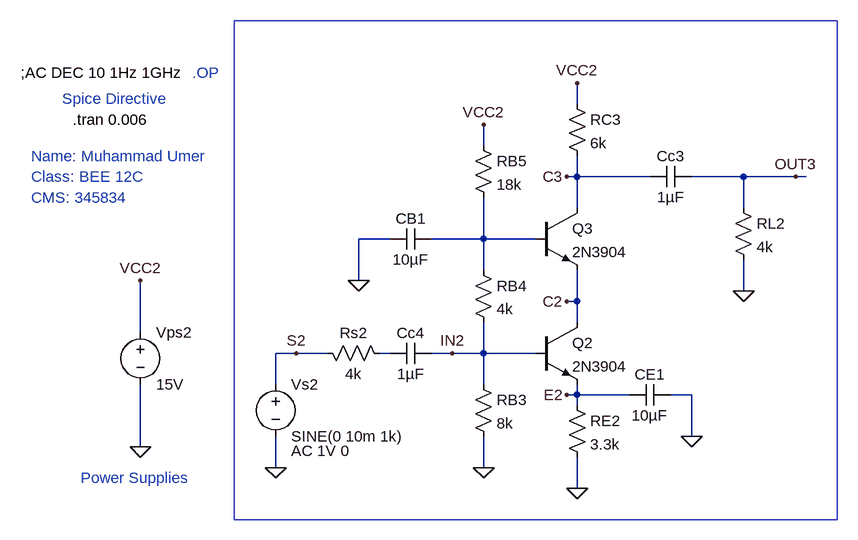
[diagram p0: schematic modified_ce_cascode.asc]
modified_ce_cascode.asc, the LTspice schematic file:
Version 4
SHEET 1 1920 1496
WIRE 736 544 736 512
WIRE 592 608 592 576
WIRE 736 656 736 624
WIRE 736 656 720 656
WIRE 848 656 736 656
WIRE 992 656 912 656
WIRE 1072 656 992 656
WIRE 1088 656 1072 656
WIRE 736 704 736 656
WIRE 992 704 992 656
WIRE 448 752 400 752
WIRE 592 752 592 688
WIRE 592 752 512 752
WIRE 672 752 592 752
WIRE 592 800 592 752
WIRE 400 816 400 752
WIRE 992 832 992 784
WIRE 736 848 736 800
WIRE 736 848 720 848
WIRE 736 880 736 848
WIRE 64 896 64 816
WIRE 304 928 272 928
WIRE 352 928 304 928
WIRE 448 928 432 928
WIRE 544 928 512 928
WIRE 592 928 592 880
WIRE 592 928 544 928
WIRE 672 928 592 928
WIRE 272 976 272 928
WIRE 592 976 592 928
WIRE 736 992 736 976
WIRE 736 992 720 992
WIRE 816 992 736 992
WIRE 912 992 880 992
WIRE 736 1008 736 992
WIRE 912 1056 912 992
WIRE 64 1072 64 976
WIRE 272 1104 272 1056
WIRE 592 1104 592 1056
WIRE 736 1136 736 1088
FLAG 736 512 VCC2
FLAG 720 848 C2
FLAG 720 992 E2
FLAG 912 1056 0
FLAG 992 832 0
FLAG 1072 656 OUT3
FLAG 592 1104 0
FLAG 272 1104 0
FLAG 304 928 S2
FLAG 544 928 IN2
FLAG 736 1136 0
FLAG 592 576 VCC2
FLAG 64 1072 0
FLAG 64 816 VCC2
FLAG 720 656 C3
FLAG 400 816 0
SYMBOL npn 672 880 R0
SYMATTR InstName Q2
SYMATTR Value 2N3904
SYMBOL res 720 992 R0
SYMATTR InstName RE2
SYMATTR Value 3.3k
SYMBOL cap 912 640 R90
WINDOW 0 0 32 VBottom 2
WINDOW 3 32 32 VTop 2
SYMATTR InstName Cc3
SYMATTR Value 1µF
SYMBOL cap 880 976 R90
WINDOW 0 0 32 VBottom 2
WINDOW 3 32 32 VTop 2
SYMATTR InstName CE1
SYMATTR Value 10µF
SYMBOL res 976 688 R0
SYMATTR InstName RL2
SYMATTR Value 4k
SYMBOL res 576 960 R0
SYMATTR InstName RB3
SYMATTR Value 8k
SYMBOL cap 512 912 R90
WINDOW 0 0 32 VBottom 2
WINDOW 3 32 32 VTop 2
SYMATTR InstName Cc4
SYMATTR Value 1µF
SYMBOL res 448 944 M270
WINDOW 0 32 56 VTop 2
WINDOW 3 0 56 VBottom 2
SYMATTR InstName Rs2
SYMATTR Value 4k
SYMBOL voltage 272 960 R0
WINDOW 123 24 118 Left 2
WINDOW 39 0 0 Left 0
SYMATTR Value2 AC 1V 0
SYMATTR InstName Vs2
SYMATTR Value SINE(0 10m 1k)
SYMBOL res 576 784 R0
SYMATTR InstName RB4
SYMATTR Value 4k
SYMBOL voltage 64 880 R0
SYMATTR InstName Vps2
SYMATTR Value 15V
SYMBOL res 576 592 R0
SYMATTR InstName RB5
SYMATTR Value 18k
SYMBOL res 720 528 R0
SYMATTR InstName RC3
SYMATTR Value 6k
SYMBOL npn 672 704 R0
SYMATTR InstName Q3
SYMATTR Value 2N3904
SYMBOL cap 512 736 R90
WINDOW 0 0 32 VBottom 2
WINDOW 3 32 32 VTop 2
SYMATTR InstName CB1
SYMATTR Value 10µF
TEXT 144 496 Left 2 ;.OP
TEXT 24 536 Center 2 ;Spice Directive
TEXT 56 1120 Center 2 ;Power Supplies
TEXT -120 496 Left 2 !;AC DEC 10 1Hz 1GHz
TEXT -104 624 Left 2 ;Name: Muhammad Umer
TEXT -104 656 Left 2 ;Class: BEE 12C
TEXT -104 688 Left 2 ;CMS: 345834
TEXT -40 568 Left 2 !.tran 0.006
RECTANGLE Normal 208 1184 1136 416

The netlist it stands for:
* modified_ce_cascode.asc
Q2 C2 IN2 E2 0 2N3904
RE2 E2 0 3.3k
Cc3 OUT3 C3 1µF
CE1 0 E2 10µF
RL2 OUT3 0 4k
RB3 IN2 0 8k
Cc4 IN2 N002 1µF
Rs2 N002 S2 4k
Vs2 S2 0 SINE(0 10m 1k) AC 1V 0
RB4 N001 IN2 4k
Vps2 VCC2 0 15V
RB5 VCC2 N001 18k
RC3 VCC2 C3 6k
Q3 C3 N001 C2 0 2N3904
CB1 N001 0 10µF
.model NPN NPN
.model PNP PNP
.lib standard.bjt
* .OP
* Spice Directive
* Power Supplies
;AC DEC 10 1Hz 1GHz
* Name: Muhammad Umer
* Class: BEE 12C
* CMS: 345834
.tran 0.006
.backanno
.end